# EAGLE design Dot_4layer_7 (EAGLE 4.16)
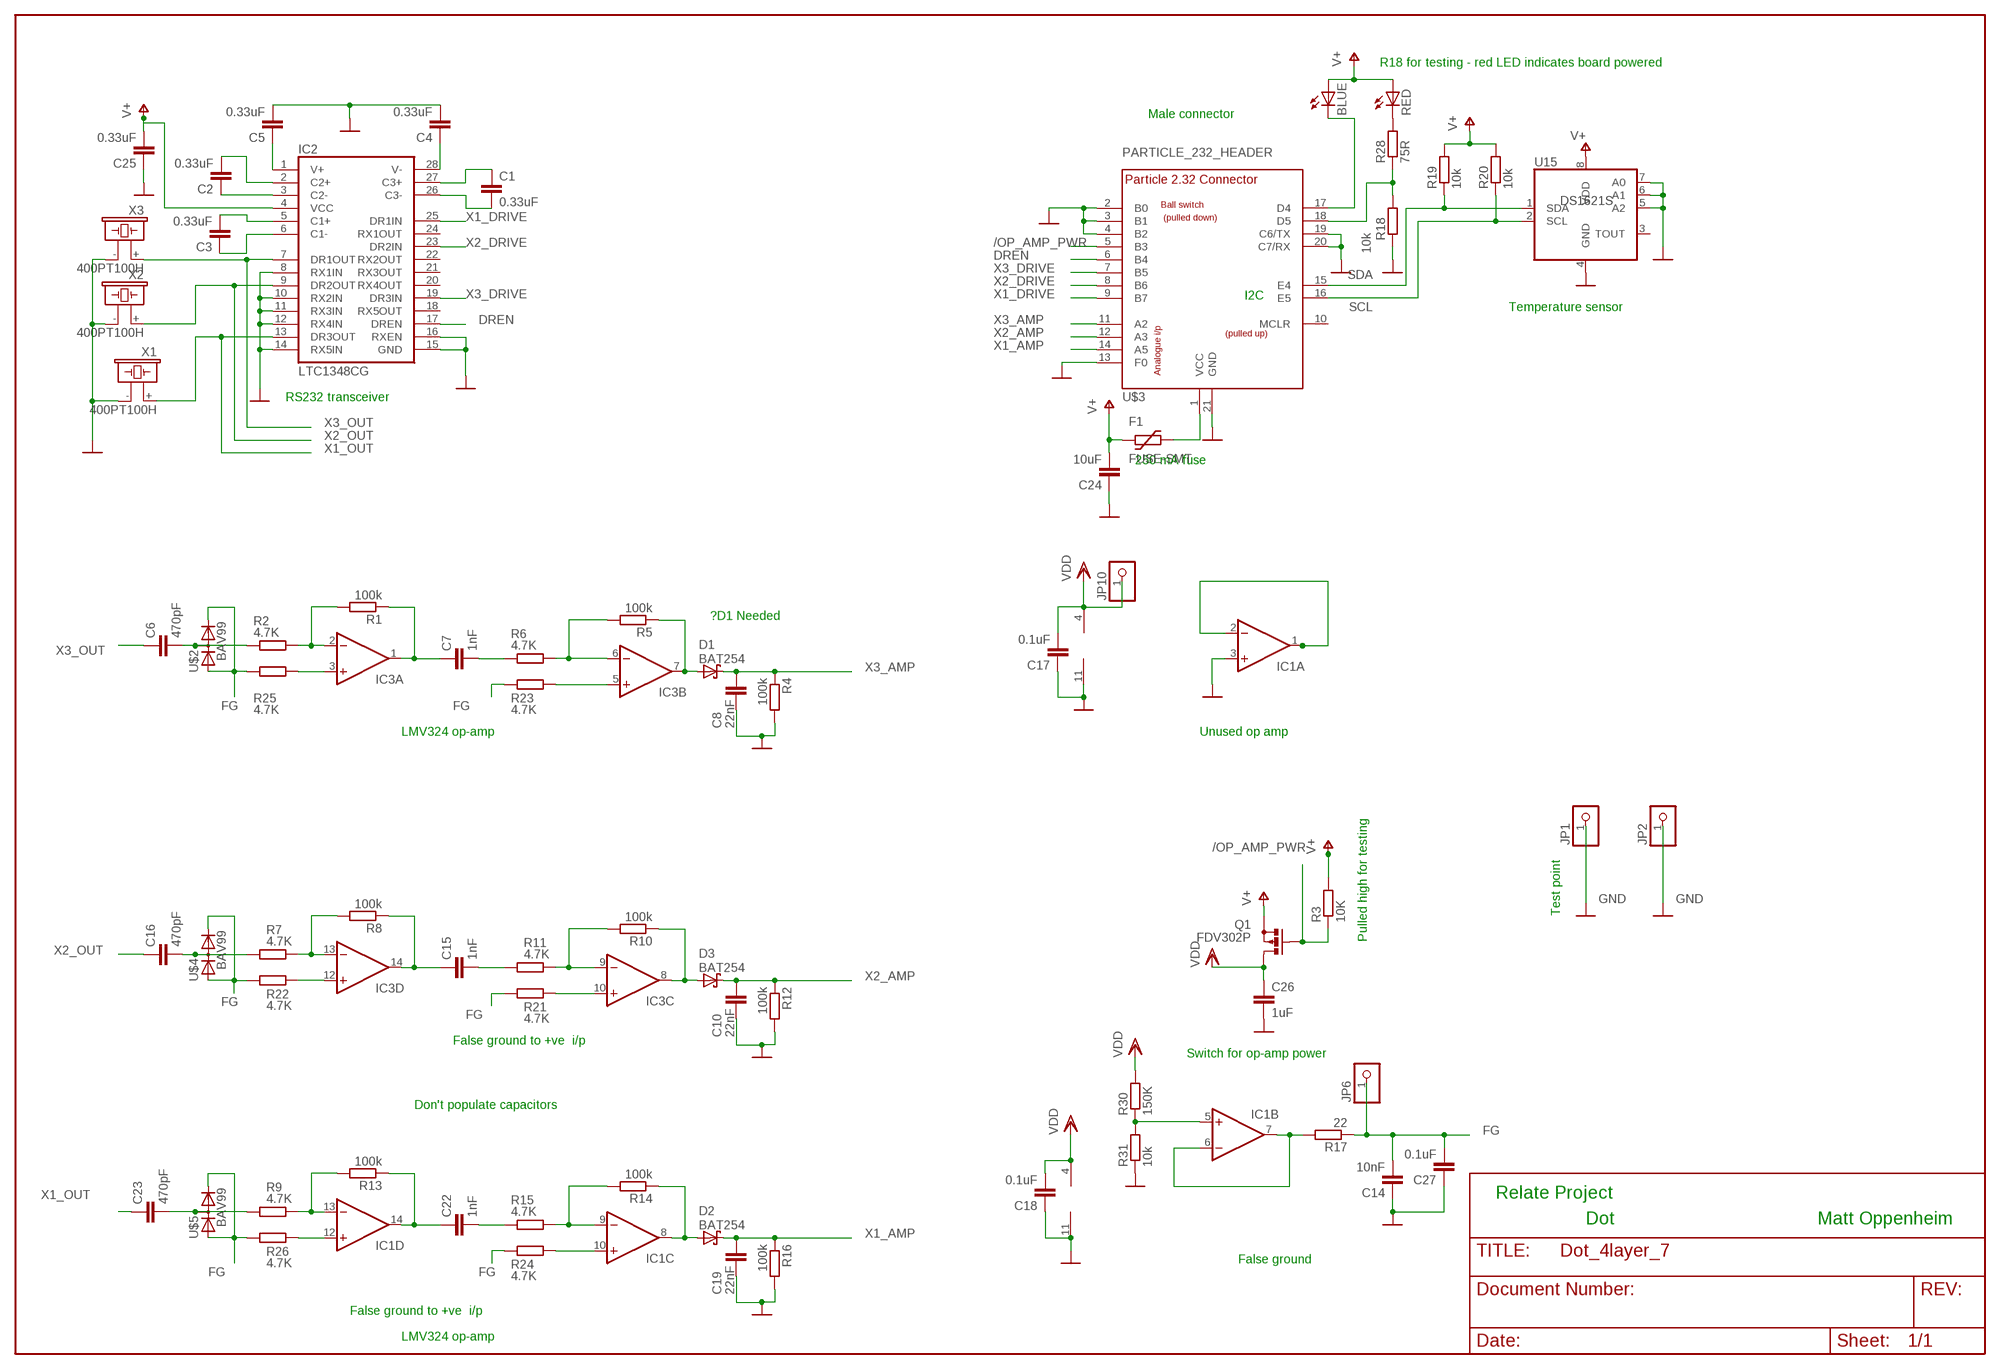
[diagram p0: schematic, sheet 1]

## Parts
BLUE  LEDCHIP-LED0805  [CHIP-LED0805]
C1  0.33uF  C-EUC0603  [C0603]
C2  0.33uF  C-EUC0603  [C0603]
C3  0.33uF  C-EUC0603  [C0603]
C4  0.33uF  C-EUC0603  [C0603]
C5  0.33uF  C-EUC0603  [C0603]
C6  470pF  C-EUC0603  [C0603]
C7  1nF  C-EUC0603  [C0603]
C8  22nF  C-EUC0603  [C0603]
C10  22nF  C-EUC0603  [C0603]
C14  10nF  C-EUC0603  [C0603]
C15  1nF  C-EUC0603  [C0603]
C16  470pF  C-EUC0603  [C0603]
C17  0.1uF  C-EUC0603  [C0603]
C18  0.1uF  C-EUC0603  [C0603]
C19  22nF  C-EUC0603  [C0603]
C22  1nF  C-EUC0603  [C0603]
C23  470pF  C-EUC0603  [C0603]
C24  10uF  C-EUC0603  [C0603]
C25  0.33uF  C-EUC0603  [C0603]
C26  1uF  C-EUC0603  [C0603]
C27  0.1uF  C-EUC0603  [C0603]
D1  BAT254  [SOD110-W]
D2  BAT254  [SOD110-W]
D3  BAT254  [SOD110-W]
F1  FUSE-SMT  [R0603]
IC1  AD8544RU  [TSSOP14]
IC2  LTC1348CG  [SSOP28]
IC3  AD8544RU  [TSSOP14]
JP1  PINHD-1X1  [1X01]
JP2  PINHD-1X1  [1X01]
JP6  PINHD-1X1  [1X01]
JP10  PINHD-1X1  [1X01]
Q1  FDV302P  [SOT23]
R1  100k  R-EU_R0603  [R0603]
R2  4.7K  R-EU_R0603  [R0603]
R3  10K  R-EU_R0603  [R0603]
R4  100k  R-EU_R0603  [R0603]
R5  100k  R-EU_R0603  [R0603]
R6  4.7K  R-EU_R0603  [R0603]
R7  4.7K  R-EU_R0603  [R0603]
R8  100k  R-EU_R0603  [R0603]
R9  4.7K  R-EU_R0603  [R0603]
R10  100k  R-EU_R0603  [R0603]
R11  4.7K  R-EU_R0603  [R0603]
R12  100k  R-EU_R0603  [R0603]
R13  100k  R-EU_R0603  [R0603]
R14  100k  R-EU_R0603  [R0603]
R15  4.7K  R-EU_R0603  [R0603]
R16  100k  R-EU_R0603  [R0603]
R17  22  R-EU_R0603  [R0603]
R18  10k  R-EU_R0603  [R0603]
R19  10k  R-EU_R0603  [R0603]
R20  10k  R-EU_R0603  [R0603]
R21  4.7K  R-EU_R0603  [R0603]
R22  4.7K  R-EU_R0603  [R0603]
R23  4.7K  R-EU_R0603  [R0603]
R24  4.7K  R-EU_R0603  [R0603]
R25  4.7K  R-EU_R0603  [R0603]
R26  4.7K  R-EU_R0603  [R0603]
R28  75R  R-EU_R0603  [R0603]
R30  150K  R-EU_R0603  [R0603]
R31  10k  R-EU_R0603  [R0603]
RED  LEDCHIP-LED0805  [CHIP-LED0805]
U15  DS1621S  [SO08]
U$2  BAV99  [SOT23]
U$3  PARTICLE_232_HEADER  [CONAN-91911-31X21]
U$4  BAV99  [SOT23]
U$5  BAV99  [SOT23]
X1  400PT100H  [PIEZOULTRASONIC10MM]
X2  400PT100H  [PIEZOULTRASONIC10MM]
X3  400PT100H  [PIEZOULTRASONIC10MM]

## Nets
/OP_AMP_PWR: Q1.1(G) R3.1 U$3.5(B3)
DREN: IC2.17(DREN) U$3.6(B4)
FG: C14.2 C27.2 JP6.1 R17.1 R21.1 R22.1 R23.1 R24.1 R25.1 R26.1 U$2.1(C) U$2.2(A) U$4.1(C) U$4.2(A) U$5.1(C) U$5.2(A)
GND: C4.2 C5.2 C8.2 C10.2 C14.1 C17.1 C18.1 C19.2 C24.1 C25.1 C26.2 C27.1 IC1.3(A:+IN) IC1.11(P:V-) IC2.8(RX1IN) IC2.10(RX2IN) IC2.11(RX3IN) IC2.12(RX4IN) IC2.14(RX5IN) IC2.15(GND) IC2.16(RXEN) IC3.11(P:V-) JP1.1 JP2.1 R4.2 R12.2 R16.2 R18.1 R31.1 U15.4(GND) U15.5(A2) U15.6(A1) U15.7(A0) U$3.2(B0) U$3.3(B1) U$3.4(B2) U$3.13(F0) U$3.19(C6/TX) U$3.20(C7/RX) U$3.21(GND) X1.- X2.- X3.-
N$1: C1.1 IC2.27(C3+)
N$2: C1.2 IC2.26(C3-)
N$3: IC1.1(A:OUT) IC1.2(A:-IN)
N$4: C6.2 R2.1 U$2.3(AC)
N$5: IC3.13(D:-IN) R7.2 R8.2
N$6: IC1.13(D:-IN) R9.2 R13.2
N$7: IC3.2(A:-IN) R1.2 R2.2
N$8: C7.1 IC3.1(A:OUT) R1.1
N$9: C3.1 IC2.6(C1-)
N$10: C3.2 IC2.5(C1+)
N$11: C2.1 IC2.3(C2-)
N$12: C2.2 IC2.2(C2+)
N$13: C5.1 IC2.1(V+)
N$14: C4.1 IC2.28(V-)
N$15: IC3.6(B:-IN) R5.2 R6.2
N$16: IC1.6(B:-IN) IC1.7(B:OUT) R17.2
N$17: D1.A IC3.7(B:OUT) R5.1
N$18: C15.1 IC3.14(D:OUT) R8.1
N$19: IC1.5(B:+IN) R30.1 R31.2
N$20: C7.2 R6.1
N$21: IC3.9(C:-IN) R10.2 R11.2
N$22: D3.A IC3.8(C:OUT) R10.1
N$23: C15.2 R11.1
N$24: C16.2 R7.1 U$4.3(AC)
N$25: IC1.12(D:+IN) R26.2
N$26: C22.1 IC1.14(D:OUT) R13.1
N$27: F1.2 U$3.1(VCC)
N$28: IC1.9(C:-IN) R14.2 R15.2
N$29: D2.A IC1.8(C:OUT) R14.1
N$30: C22.2 R15.1
N$31: C23.2 R9.1 U$5.3(AC)
N$32: IC3.10(C:+IN) R21.2
N$33: IC3.12(D:+IN) R22.2
N$34: IC3.5(B:+IN) R23.2
N$35: IC1.10(C:+IN) R24.2
N$36: IC3.3(A:+IN) R25.2
N$38: R28.2 RED.C
N$39: R18.2 R28.1 U$3.18(D5)
N$40: BLUE.C U$3.17(D4)
SCL: R20.1 U15.2(SCL) U$3.16(E5)
SDA: R19.1 U15.1(SDA) U$3.15(E4)
V+: BLUE.A C24.2 C25.2 F1.1 IC2.4(VCC) Q1.2(S) R3.2 R19.2 R20.2 RED.A U15.8(VDD)
VDD: C17.2 C18.2 C26.1 IC1.4(P:V+) IC3.4(P:V+) JP10.1 Q1.3(D) R30.2
X1_AMP: C19.1 D2.C R16.1 U$3.14(A5)
X1_DRIVE: IC2.25(DR1IN) U$3.9(B7)
X1_OUT: C23.1 IC2.13(DR3OUT) X1.+
X2_AMP: C10.1 D3.C R12.1 U$3.12(A3)
X2_DRIVE: IC2.23(DR2IN) U$3.8(B6)
X2_OUT: C16.1 IC2.9(DR2OUT) X2.+
X3_AMP: C8.1 D1.C R4.1 U$3.11(A2)
X3_DRIVE: IC2.19(DR3IN) U$3.7(B5)
X3_OUT: C6.1 IC2.7(DR1OUT) X3.+
Unconnected: IC2.18(RX5OUT) IC2.20(RX4OUT) IC2.21(RX3OUT) IC2.22(RX2OUT) IC2.24(RX1OUT) U15.3(TOUT) U$3.10(MCLR)

## Notes on the sheet
- R18 for testing - red LED indicates board powered
- Male connector
- I2C
- Temperature sensor
- RS232 transceiver
- 250 mA fuse
- ?D1 Needed
- LMV324 op-amp | Unused op amp
- Test point
- Pulled high for testing
- False ground to +ve  i/p
- Switch for op-amp power
- Don't populate capacitors
- Relate Project
- Dot | Matt Oppenheim
- False ground
- False ground to +ve  i/p
- LMV324 op-amp

## Library data of the parts
BLUE RED = led:LED: LED OSRAM: - CHIPLED LG R971, LG N971, LY N971, LG Q971, LY Q971, LO R971, LY R971 LH N974, LH R974 LS Q976, LO Q976, LY Q976 LO Q996 - Hyper CHIPLED LW Q18S LB Q993, LB Q99A, LB R99A - SideLED LS A670, LO A670, LY A670, LG A670, LP A670 LB A673, LV A673, LT A673, LW A673 LH A674 LY A675 LS A676, LA A676, LO A676, LY A676, LW A676 LS A679, LY A679, LG A679 - Hyper Micro SIDELED® LS Y876, LA Y876, LO Y876, LY Y876 LT Y87S - SmartLED LW L88C, LW L88S LB L89C, LB L89S, LG L890 LS L89K, LO L89K, LY L89K LS L896, LA L896, LO L896, LY L896 - TOPLED LS T670, LO T670, LY T670, LG T670, LP T670 LSG T670, LSP T670, LSY T670, LOP T670, LYG T670 LG T671, LOG T671, LSG T671 LB T673, LV T673, LT T673, LW T673 LH T674 LS T676, LA T676, LO T676, LY T676, LB T676, LH T676, LSB T676, LW T676 LB T67C, LV T67C, LT T67C, LS T67K, LO T67K, LY T67K, LW E67C LS E67B, LA E67B, LO E67B, LY E67B, LB E67C, LV E67C, LT E67C LW T67C LS T679, LY T679, LG T679 LS T770, LO T770, LY T770, LG T770, LP T770 LB T773, LV T773, LT T773, LW T773 LH T774 LS E675, LA E675, LY E675, LS T675 LS T776, LA T776, LO T776, LY T776, LB T776 LHGB T686 LT T68C, LB T68C - Hyper Mini TOPLED® LB M676 - Mini TOPLED Santana® LG M470 LS M47K, LO M47K, LY M47K Source: http://www.osram.convergy.de/
C1-C8 C10 C14-C19 C22-C27 = rcl:C-EU: CAPACITOR, European symbol
D1-D3 = Dot boards:BAT254
F1 = Temp:FUSE-SMT
IC1 IC3 = Dot boards:AD8544: OP AMP
IC2 = Dot boards:LTC1348*: 3.3V/5V low power RS232 3-driver/5-receiver transceiver Linear Technology
JP1 JP2 JP6 JP10 = pinhead:PINHD-1X1: PIN HEADER
Q1 = hazas:FDV302P: PMOSFET
R1-R26 R28 R30 R31 = rcl:R-EU_: RESISTOR, European symbol
U15 = hazas:DS1621
U$2 U$4 U$5 = Temp:BAV99
U$3 = Dot boards:PARTICLE_232
X1-X3 = Dot boards:400PT100*: 400PT100 40kHz Transducer Prowave 40kHz transducer.

## Board
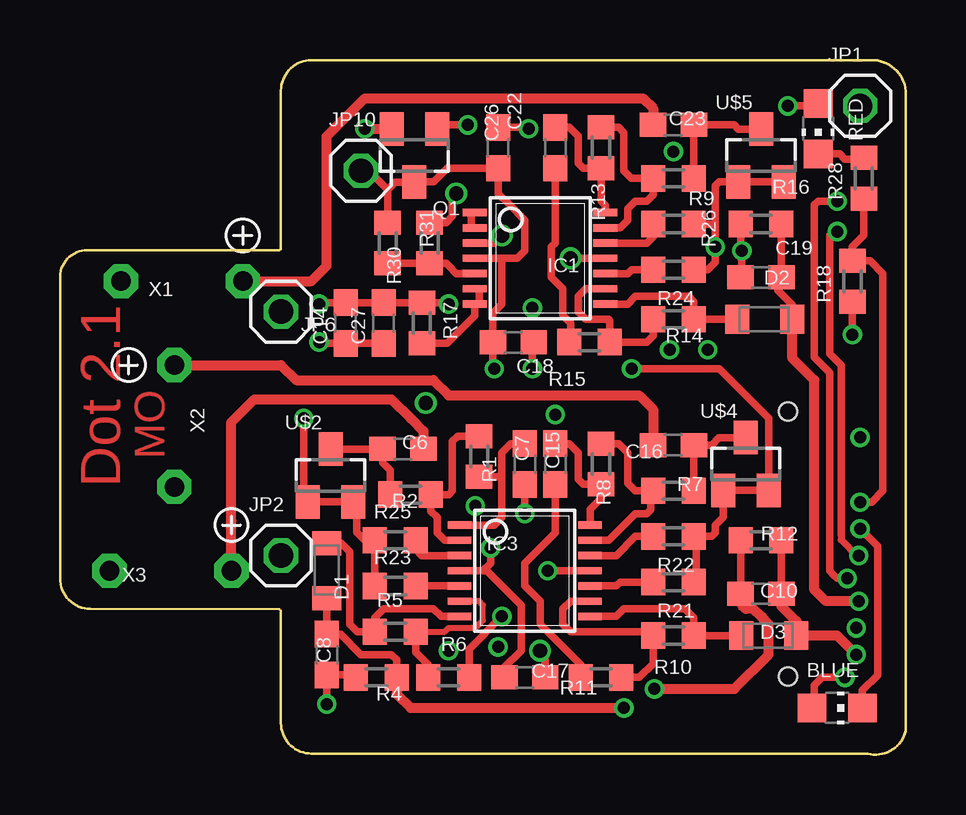
[diagram p1: board, top side]
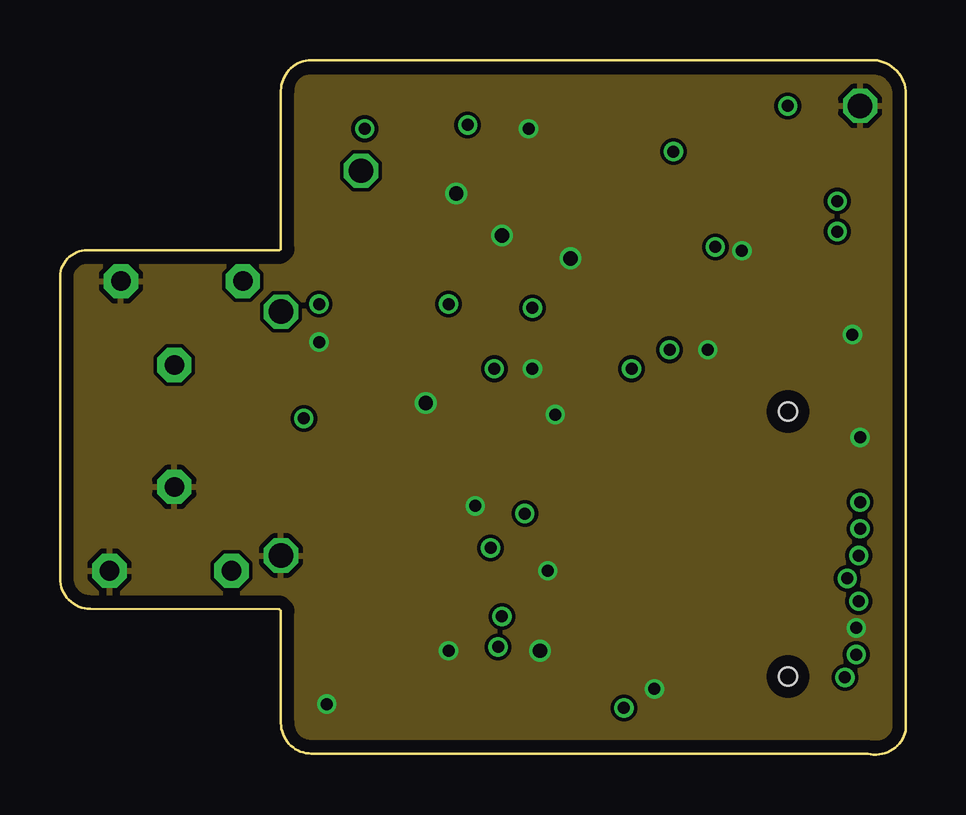
[diagram p2: board, inner layer Route2]
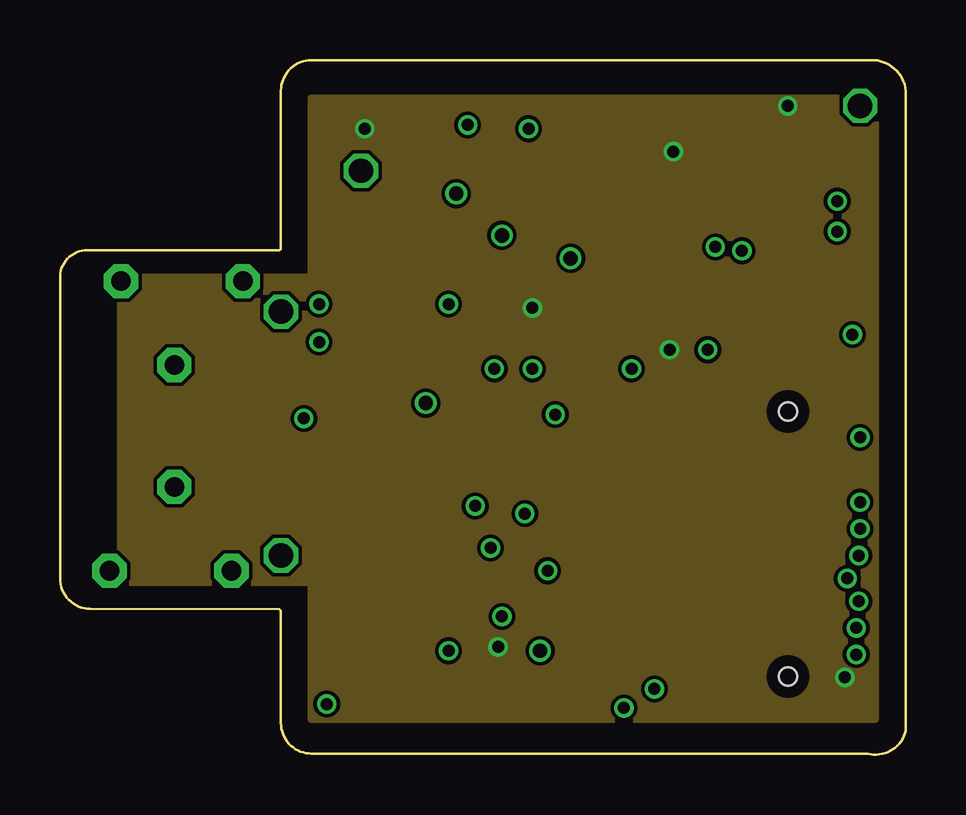
[diagram p3: board, inner layer Route15]
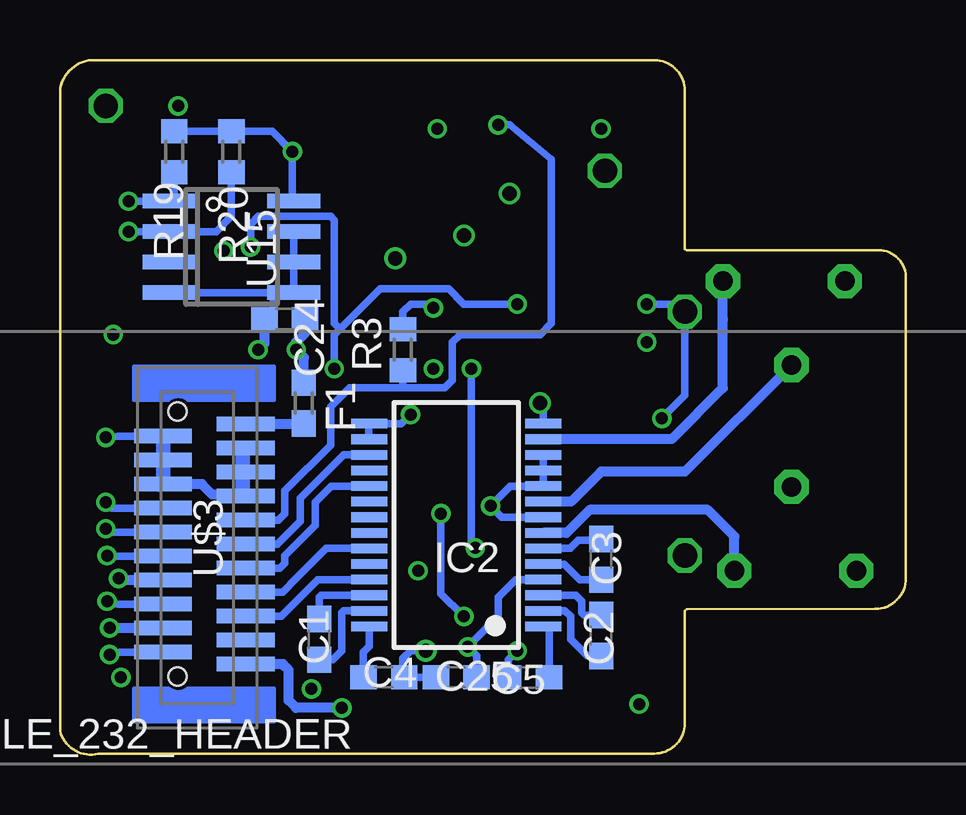
[diagram p4: board, bottom side, seen from below]

Size 35.24 x 28.94 mm. Coordinates in mm from the lower left corner, seen from the top.
Outline: 9.13,21 1.37,21 arc90 0,20.04 0,7.34 arc90 1.27,6.07 9.13,6.06
Outline: 9.21,21.06 9.21,27.66 arc-90 10.48,28.93 33.66,28.93 arc-90 35.24,27.66 35.24,0.99 arc-90 33.66,0.04 10.48,0.04 arc-90 9.21,1.31 9.21,5.98
Copper layers (1+2*15+16): Top 0.035mm / dielectric 1.5mm / Route2 0.035mm / dielectric 0.15mm / Route15 0.035mm / dielectric 0.2mm / Bottom 0.035mm
Design rules "PCB-POOL": minimum track width 6mil, minimum drill 12mil, track to track 6mil, track to pad 6mil, pad to pad 6mil, via to via 6mil, smd to smd 6mil, copper to edge 20mil, drill to drill 8mil, minimum pad ring 8mil, minimum via ring 6mil, stop-mask expansion 3mil, vias tented up to drill 0mil, thermal gap 8mil

### Footprints (pad centres in the part's own frame; a part is rotated, then mirrored left to right if it is on the bottom)
CHIP-LED0805 = smd 1.2 x 1.2: A 0,-1.05; C 0,1.05
C0603 = smd 1.1 x 1: 1 -0.85,0; 2 0.85,0
SOD110-W = smd 1 x 1.2: A 1.15,0; C -1.15,0
R0603 = smd 1.1 x 1: 1 -0.85,0; 2 0.85,0
TSSOP14 = smd 0.305 x 0.991: 1 -1.905,-2.718; 2 -1.27,-2.718; 3 -0.635,-2.718; 4 0,-2.718; 5 0.635,-2.718; 6 1.27,-2.718; 7 1.905,-2.718; 8 1.905,2.718; 9 1.27,2.718; 10 0.635,2.718; 11 0,2.718; 12 -0.635,2.718; 13 -1.27,2.718; 14 -1.905,2.718
SSOP28 = smd 0.4 x 1.5: 1 -4.225,-3.625; 2 -3.575,-3.625; 3 -2.925,-3.625; 4 -2.275,-3.625; 5 -1.625,-3.625; 6 -0.975,-3.625; 7 -0.325,-3.625; 8 0.325,-3.625; 9 0.975,-3.625; 10 1.625,-3.625; 11 2.275,-3.625; 12 2.925,-3.625; 13 3.575,-3.625; 14 4.225,-3.625; 15 4.225,3.625; 16 3.575,3.625; 17 2.925,3.625; 18 2.275,3.625; 19 1.625,3.625; 20 0.975,3.625; 21 0.325,3.625; 22 -0.325,3.625; 23 -0.975,3.625; 24 -1.625,3.625; 25 -2.275,3.625; 26 -2.925,3.625; 27 -3.575,3.625; 28 -4.225,3.625
1X01 = drill 1.016 octagon: 1 0,0
SOT23 = smd 1 x 1.4: 1 -0.95,-1.1; 2 0.95,-1.1; 3 0,1.1
R0603' = smd 1 x 1.1: 1 -0.85,0; 2 0.85,0
SO08 = smd 0.6 x 2.2: 1 -1.905,-2.6; 2 -0.635,-2.6; 3 0.635,-2.6; 4 1.905,-2.6; 5 1.905,2.6; 6 0.635,2.6; 7 -0.635,2.6; 8 -1.905,2.6
CONAN-91911-31X21 = smd 0.61 x 2.41: 1 -5,1.7; 2 -4,1.7; 3 -3,1.7; 4 -2,1.7; 5 -1,1.7; 6 0,1.7; 7 1,1.7; 8 2,1.7; 9 3,1.7; 10 4,1.7; 11 5,1.7; 12 4.5,-1.74; 13 3.5,-1.74; 14 2.5,-1.74; 15 1.5,-1.74; 16 0.5,-1.74; 17 -0.5,-1.74; 18 -1.5,-1.74; 19 -2.5,-1.74; 20 -3.5,-1.74; 21 -4.5,-1.74 | hole 0.76: -5.52,-1.13; 5.52,-1.13
PIEZOULTRASONIC10MM = drill 0.813 pad 1.422 octagon: + 2.54,0; - -2.54,0

### Placement (x,y rotation side)
BLUE  32.38,1.94 270 top
C1  24.45,4.8 90 bottom
C2  12.7,4.96 270 bottom
C3  12.7,8.13 270 bottom
C4  21.75,3.21 0 bottom
C5  15.72,3.21 180 bottom
C6  14.29,12.74 180 top
C7  19.37,12.1 270 top
C8  11.11,4.17 270 top
C10  29.21,6.71 180 top
C14  11.91,17.98 90 top
C15  20.64,12.1 270 top
C16  25.56,12.9 0 top
C17  19.37,3.21 180 top
C18  18.89,17.18 180 top
C19  29.21,19.88 180 top
C22  20.64,25.28 270 top
C23  25.56,26.23 0 top
C24  25.88,18.14 0 bottom
C25  18.73,3.21 0 bottom
C26  18.26,25.28 90 top
C27  13.49,17.98 90 top
D1  11.11,7.66 90 top
D2  29.37,18.14 180 top
D3  29.53,4.96 180 top
F1  25.08,14.64 270 bottom
IC1  20,20.68 270 top
IC2  18.73,9.56 90 bottom
IC3  19.37,7.66 270 top
JP1  33.34,27.03 0 top
JP2  9.21,8.29 0 top
JP6  9.21,18.45 90 top
JP10  12.54,24.33 0 top
Q1  14.76,24.96 180 top
R1  100k  [R0603']  17.46,12.42 90 top
R2  4.7K  [R0603']  14.61,10.83 0 top
R3  10K  [R0603']  20.95,16.87 90 bottom
R4  100k  [R0603']  13.18,3.21 180 top
R5  100k  [R0603']  13.97,5.12 0 top
R6  4.7K  [R0603']  16.19,3.21 180 top
R7  4.7K  [R0603']  25.56,10.99 180 top
R8  100k  [R0603']  22.54,12.1 90 top
R9  4.7K  [R0603']  25.56,24.01 180 top
R10  100k  [R0603']  25.56,4.96 180 top
R11  4.7K  [R0603']  22.54,3.21 0 top
R12  100k  [R0603']  29.21,8.93 180 top
R13  100k  [R0603']  22.54,25.28 90 top
R14  100k  [R0603']  25.56,18.14 180 top
R15  4.7K  [R0603']  22.07,17.18 0 top
R16  100k  [R0603']  29.21,22.1 180 top
R17  22  [R0603']  15.08,17.98 270 top
R18  10k  [R0603']  33.02,19.72 90 top
R19  10k  [R0603']  30.48,25.12 90 bottom
R20  10k  [R0603']  28.1,25.12 90 bottom
R21  4.7K  [R0603']  25.56,7.18 180 top
R22  4.7K  [R0603']  25.56,9.09 180 top
R23  4.7K  [R0603']  13.97,7.02 0 top
R24  4.7K  [R0603']  25.56,20.2 180 top
R25  4.7K  [R0603']  13.97,8.93 0 top
R26  4.7K  [R0603']  25.56,22.1 180 top
R28  75R  [R0603']  33.5,24.01 90 top
R30  150K  [R0603']  13.65,21.31 90 top
R31  10k  [R0603']  15.4,21.31 270 top
RED  31.59,26.07 180 top
U15  28.1,21.15 270 bottom
U$1  [PARTICLE]  29.53,8.61 0 bottom
U$2  11.27,11.63 0 top
U$3  29.21,8.77 270 bottom
U$4  28.58,12.1 0 top
U$5  29.21,24.96 0 top
X1  5.08,19.72 0 top
X2  4.76,13.69 90 top
X3  4.6,7.66 0 top

### Tracks (layer width: path | path; a pad name or v marks a point on that pad's centre or on a via)
/OP_AMP_PWR  (via drill 0.5)
  Top 0.305: Q1.1 15.86,26.06 16.03,26.23 v16.99,26.23
  Bottom 0.305: U$3.5 26.15,9.77 25.88,10.04 25.88,10.99 23.97,12.9 23.97,14.48 23.18,15.28 20.95,15.28 | v16.99,26.23 16.51,26.23 14.76,24.8 14.76,17.98 15.24,17.5 18.57,17.5 18.89,17.18 18.89,15.6 19.21,15.28 20.95,15.28 | 20.95,15.28 R3.1
DREN
  Bottom 0.305: IC2.17 23.43,12.49 25.24,10.67 25.24,9.72 26.19,8.77 | 26.19,8.77 U$3.6 | 26.19,8.77
FG  (via drill 0.5)
  Top 0.305: 13.65,18.77 13.6,18.83 C14.2 10.85,18.83 v10.79,18.77 | 13.65,18.77 | 13.65,18.77 C27.2 | 13.65,18.77 13.71,18.83 R17.1 16.14,18.83 v16.19,18.77 | R24.1 26.99,20.2 27.15,20.36 | 27.15,20.36 | 27.15,20.36 27.31,20.52 v27.31,21.15 27.31,22.1 | 26.51,7.18 R21.1 26.41,7.08 | 26.51,7.18 26.67,7.34 | v23.81,16.07 27.46,16.07 29.52,14.01 U$4.2 27.79,11 27.63,10.84 | 26.51,9.09 R22.1 | 26.51,9.09 27.15,9.09 27.31,9.25 27.31,9.56 27.63,9.88 U$4.1 27.63,10.84 | 26.41,7.08 26.35,7.02 | 26.51,9.09 26.51,7.18 | 26.51,7.18 26.41,7.08 | 27.63,10.84 27.62,10.83 | U$5.1 | U$5.1 27.48,23.86 27.31,23.69 27.31,22.1 | U$5.2 U$5.1 | 10.47,10.53 10.48,10.52 | 10.47,10.53 U$2.1 | v10.16,14.01 10.16,10.83 10.47,10.53 | 12.37,10.53 U$2.2 | 12.37,10.53 10.47,10.53 | 12.37,10.53 12.38,10.52 | 12.37,10.53 12.37,9.26 12.7,8.93 R25.1 13.12,7.13 13.02,7.02 R23.1 | 27.31,22.1 R26.1
  Bottom 0.305: v16.19,18.77 18.41,18.77 19.05,19.41 21.91,19.41 23.57,17.74 | v23.81,16.07 23.81,17.5 23.57,17.74 | JP6.1 9.52,18.77 v10.79,18.77 9.21,18.77 9.21,14.96 v10.16,14.01 | v27.31,21.15 27.31,22.1 26.99,22.42 23.97,22.42 23.81,22.26 23.81,17.98 23.57,17.74
GND  (via drill 0.5, 0.6)
  Top 0.305: IC1.3 18.1,21.31 v18.41,21.63 | IC1.11 v21.27,20.68 | 13.65,17.18 | 13.65,17.18 C27.1 10.85,17.13 v10.79,17.18 | C14.1 13.6,17.13 13.65,17.18 | C18.1 19.69,17.18 v19.69,16.07 | C26.2 19.42,26.13 v19.53,26.07 | v28.42,20.99 | R16.2 28.36,21.05 v28.42,20.99 | C10.2 28.42,6.71 28.36,6.76 R12.2 | v20.32,7.66 IC3.11 | v11.11,2.1 C8.2 12.28,3.32 12.38,3.21 R4.2 | 28.36,20.04 28.26,20.04 | C19.2 28.36,20.04 | v28.42,20.99 28.42,20.04 28.36,20.04 | v20,4.32 | v20,4.32 20.06,4.27 | v33.02,17.5 R18.1 | R31.1 16.09,22.16 16.35,22.42 16.35,23.06 16.51,23.22 v16.51,23.37 | v20,4.32 20,4.17 20.22,3.95 C17.1
  Top 0.406: 28.42,6.71 28.42,6.23 28.58,6.07 28.89,6.07 29.21,5.75 | 29.21,5.75 | 29.37,5.59 29.21,5.75 | 29.37,5.59 | 29.37,5.59 29.53,5.44 29.53,4.17 28.1,2.74 v24.77,2.74
  Bottom 0.305: IC2.11 IC2.10 16.47,11.19 v17.3,10.36 | IC2.11 IC2.12 15.11,11.92 15.19,11.84 | v20,4.32 20.64,4.32 20.95,4.01 20.95,3.21 | U15.5 U15.6 | U15.6 U15.7 | 26.35,18.14 | 26.35,18.14 C24.1 | 25.56,19.25 26.35,19.25 26.35,18.14 | 25.56,19.25 U15.4 | U15.5 U15.6 | U15.5 25.56,19.25 | U$3.21 32.81,13.27 v33.34,13.21 | 20.95,3.21 C4.2 | C25.1 20.95,3.21 | 15.19,11.84 15.24,11.79 | IC2.11 15.19,11.84 | 22.38,13.79 22.38,13.85 | 22.38,13.79 IC2.15 21.02,13.79 v20.64,14.17 | IC2.16 22.38,13.14 22.38,13.79 | v15.24,14.64 | IC2.14 15.11,14.51 v15.24,14.64 | C5.2 16.57,3.95 v16.19,4.32 | IC2.8 16.84,9.89 v17.3,10.36 | v17.3,10.36
  Bottom 0.406: 27.62,10.77 27.62,10.83 28.89,10.83 29.33,11.27 U$3.19 31,11.27 | v33.18,5.28 32.86,5.28 32.85,5.27 U$3.13 | 31,11.27 31.12,11.15 | U$3.20 30.95,11.32 31,11.27 | C24.1 26.73,17.13 v26.99,16.87
  Bottom 0.61: U$3.2 27.62,12.77 27.62,11.77 | U$3.4 27.62,10.77 27.62,11.77 | U$3.3 27.62,11.77 | U$3.19 30.95,11.31 | 30.95,11.31 U$3.20 U$3.21 | 30.95,11.31 31.12,11.31
  pour Route2: 0.48,6.39 0.48,20.68 9.37,20.83 9.37,28.3 34.61,28.3 34.61,0.67 9.41,0.67 9.41,6.39
N$1
  Bottom 0.305: IC2.27 23.42,5.99 23.49,5.91 23.49,4.32 23.87,3.95 C1.1
N$2
  Bottom 0.305: IC2.26 24.36,6.64 24.45,6.55 C1.2
N$3
  Top 0.305: IC1.1 17.14,22.58 17.14,21.95 IC1.2
N$4
  Top 0.305: U$2.3 13.32,12.73 13.34,12.74 C6.2 13.44,12.16 13.75,11.84 R2.1
N$5
  Top 0.305: IC3.13 22.86,8.93 23.97,10.04 24.45,10.04 24.61,10.2 24.61,10.83 24.71,10.94 R7.2 23.97,10.99 23.65,11.31 23.65,12.58 23.28,12.95 R8.2
N$6
  Top 0.305: R13.2 23.28,26.13 23.49,25.91 23.49,24.33 23.81,24.01 R9.2 24.71,23.32 24.45,23.06 23.97,23.06 23.65,22.74 23.65,22.26 23.34,21.95 IC1.13
N$7
  Top 0.305: R1.2 16.57,13.27 16.35,13.06 16.35,10.99 16.19,10.83 R2.2 15.45,10.14 15.72,9.88 15.72,9.25 16.03,8.93 IC3.2
N$8
  Top 0.305: IC3.1 18.1,9.56 18.41,9.88 18.41,11.47 | 18.41,11.47 18.41,11.63 | 18.41,11.63 18.41,11.79 | 18.41,11.63 18.41,12.58 18.79,12.95 C7.1 | R1.1 18.31,11.57 18.41,11.47
N$9
  Bottom 0.305: IC2.6 13.99,8.59 13.65,8.93 13.02,8.93 12.96,8.98 C3.1
N$10
  Bottom 0.305: IC2.5 14.96,7.94 14.92,7.98 14.87,7.92 14.23,7.92 13.6,7.28 C3.2
N$11
  Bottom 0.305: C2.1 13.39,5.81 13.49,5.91 13.49,6.39 13.74,6.64 IC2.3
N$12
  Bottom 0.305: C2.2 13.28,4.11 13.97,4.8 13.97,5.75 14.2,5.99 IC2.2
N$13
  Bottom 0.305: IC2.1 15.11,5.28 14.87,5.28 C5.1
N$14
  Bottom 0.305: IC2.28 22.36,4.51 22.6,4.27 C4.1
N$15
  Top 0.254: IC3.6 17.46,6.39 17.62,6.23 17.62,5.59 17.46,5.44 17.3,5.28 16.19,5.28 16.03,5.12 R5.2
  Top 0.305: R5.2 14.82,4.27 15.34,3.75 R6.2
N$16
  Top 0.305: R17.2 16.14,17.13 17.28,18.28 IC1.7 17.46,18.77 17.46,19.41 IC1.6
N$17
  Top 0.305: IC3.7 15.88,5.75 15.56,6.07 13.49,6.07 13.12,5.7 R5.1 12.38,5.12 12.06,5.44 12.06,8.45 11.71,8.81 D1.A
N$18
  Top 0.305: C15.1 21.22,12.95 21.59,12.58 21.59,11.47 21.81,11.25 R8.1 | IC3.14 22.09,10.22 22.54,10.67 R8.1 | R8.1 22.54,11.31
N$19
  Top 0.305: IC1.5 16.51,20.04 16.19,20.36 16.09,20.46 R31.2 15.45,20.46 15.46,20.46 | R30.1 15.46,20.46 | 15.46,20.46 15.56,20.36
N$20  (via drill 0.5)
  Top 0.305: 19.37,10.2 | v19.37,10.04 19.37,10.2 | 19.37,10.2 C7.2 | R6.1 17.04,4.38 v18.42,5.75
  Bottom 0.305: v18.41,5.75 v18.42,5.75 19.37,6.71 v19.37,10.04
N$21
  Top 0.305: R11.2 24.13,3.21 24.71,3.79 R10.2 24.71,5.06 24.77,5.12 21.27,5.12 20.95,5.44 20.95,6.07 21.27,6.39 IC3.9
N$22
  Top 0.305: D3.A R10.1 26.41,5.7 26.03,6.07 23.49,6.07 23.18,5.75 IC3.8
N$23
  Top 0.305: C15.2 20.64,9.25 19.37,7.98 19.37,7.02 20,6.39 20,5.44 21.69,3.75 R11.1
N$24
  Top 0.305: R7.1 26.41,11.09 26.35,11.15 26.41,11.21 C16.2 27.15,12.9 27.45,13.2 U$4.3
N$25
  Top 0.305: R26.2 24.71,21.57 24.45,21.31 IC1.12
N$26
  Top 0.305: IC1.14 22.72,22.88 22.54,23.06 R13.1 21.81,24.43 21.59,24.64 21.59,25.76 21.22,26.13 C22.1
N$27
  Bottom 0.406: 25.32,13.77 U$3.1
  Bottom 0.61: F1.2 25.08,14.01 25.32,13.77
N$28
  Top 0.305: IC1.9 21.91,19.41 21.59,19.09 21.59,18.45 21.91,18.14 22.86,18.14 22.92,18.08 R15.2 24.45,17.18 24.71,17.44 R14.2
N$29
  Top 0.305: D2.A R14.1 26.41,18.87 26.19,19.09 23.97,19.09 23.65,18.77 IC1.8
N$30
  Top 0.305: 21.27,17.18 | R15.1 21.27,17.18 | 21.27,17.18 21.27,17.98 20.95,18.29 20.95,19.41 20.48,19.88 20.48,21.15 20.64,21.31 C22.2
N$31
  Top 0.305: U$5.3 28.27,26.06 28.1,26.23 C23.2 26.41,24.27 26.51,24.17 26.41,24.07 R9.1
N$32
  Top 0.305: IC3.10 23.18,7.02 23.34,7.18 R21.2
N$33
  Top 0.305: IC3.12 23.18,8.29 23.97,9.09 R22.2
N$34
  Top 0.305: R23.2 15.56,7.02 | 15.56,7.02 15.72,7.02 | 15.56,7.02 IC3.5
N$35
  Top 0.305: R24.2 23.81,20.2 23.65,20.04 IC1.10
N$36
  Top 0.305: R25.2 14.82,8.55 15.08,8.29 IC3.3
N$38
  Top 0.305: RED.C 32.48,25.02 32.7,24.8 33.34,24.8 33.39,24.86 R28.2
N$39  (via drill 0.5)
  Top 0.305: v33.34,10.52 33.81,10.52 34.29,10.99 34.29,20.04 33.76,20.57 R18.2 33.02,21.15 33.5,21.63 R28.1 33.5,23.37
  Bottom 0.305: U$3.18 33.09,10.27 v33.34,10.52
N$40  (via drill 0.5)
  Top 0.305: BLUE.C 33.44,2.68 34.07,3.31 34.07,8.67 v33.34,9.4
  Bottom 0.305: U$3.17 33.31,9.27 v33.34,9.4
SCL  (via drill 0.5)
  Top 0.3: v33.28,8.29 33.2,8.29 32.54,8.95 32.54,9.13
  Top 0.305: v32.38,21.79 32.23,21.79 32.07,21.63 32.07,16.71 32.54,16.23 32.54,9.13
  Bottom 0.305: R20.1 28.1,22.42 28.73,21.79 U15.2 v32.38,21.79 | v33.28,8.29 33.18,8.29 33.16,8.27 U$3.16
SDA  (via drill 0.5)
  Top 0.305: v32.38,23.06 31.59,23.06 31.43,22.9 31.43,16.55 32.07,15.91 32.07,7.66 | 32.07,7.66 | 32.23,7.5 32.07,7.66 | v32.8,7.34 32.38,7.34 32.23,7.5 | 32.23,7.5
  Bottom 0.305: R19.1 30.48,23.22 30.64,23.06 U15.1 v32.38,23.06
  Bottom 0.406: v32.8,7.34 32.7,7.34 32.63,7.27 U$3.15
V+  (via drill 0.5)
  Top 0.305: RED.A 31.75,27.03 v30.32,27.03 | v32.7,3.21 31.75,3.21 31.43,2.9 31.43,1.94 BLUE.A
  Top 0.406: Q1.2 13.66,26.06 13.65,26.07 v12.7,26.07
  Bottom 0.305: R3.2 20.95,18.45 20.64,18.77 19.69,18.77 v19.69,18.61 | U15.8 25.4,23.06 25.5,23.16 25.56,23.16 v25.56,25.12 | 27.94,25.97 R20.2 26.41,25.97 v25.56,25.12 | 27.94,25.97 R19.2 | 27.94,25.97 27.94,26.07 | v25.56,25.12 | IC2.4 16.25,7.29 16.99,6.55 16.99,5.75 v18.26,4.48 | C25.2 17.88,4.11 v18.26,4.48 | v18.26,4.48
  Bottom 0.406: F1.1 25.08,16.55 v25.4,16.87 25.4,17.18 25.24,17.34 | 25.24,17.34 | C24.2 25.03,17.56 25.24,17.34
  pour Route15: 2.54,19.88 10.48,19.88 10.48,27.34 33.97,27.34 33.97,1.47 10.48,1.47 10.48,7.18 2.54,7.18
VDD  (via drill 0.5)
  Top 0.305: 18.41,20.68 IC1.4 | 18.41,20.68 19.05,20.68 19.37,20.99 19.37,22.26 18.73,22.9 | 18.73,22.9 | 18.73,22.9 18.26,23.37 C26.1 16.14,24.43 15.57,23.86 Q1.3 14.62,23.86 14.61,23.85 13.97,23.85 13.65,23.53 | 18.41,20.68 18.41,18.77 18.04,18.4 C18.2 18.04,16.13 v18.1,16.07 | 13.65,23.53 R30.2 | 17.62,7.66 17.78,7.66 18.1,7.34 | 17.62,7.66 IC3.4 | 18.1,7.34 | 18.26,7.18 18.1,7.34 | 18.26,7.18 | v17.94,8.61 17.94,7.98 17.62,7.66 | 13.65,23.53 | JP10.1 12.86,24.33 13.65,23.53 | 18.26,7.18 19.05,6.39 19.21,6.23 19.21,4.32 18.52,3.63 C17.2
  Bottom 0.305: v17.94,8.61 18.1,8.77 v18.1,16.07
X1_AMP  (via drill 0.5)
  Top 0.305: D2.C 30.52,18.73 29.9,19.35 C19.1 30.06,19.83 | 30.06,19.83 R16.1 | 30.06,19.83 30.16,19.72
  Top 0.406: 30.8,17.82 D2.C 30.52,16.51 31.43,15.6 31.43,6.86 31.91,6.39 v33.28,6.39
  Bottom 0.305: U$3.14 32.82,6.27 v33.28,6.39
X1_DRIVE
  Bottom 0.305: IC2.25 24.5,7.29 26.02,5.77 U$3.9
X1_OUT
  Top 0.406: X1.+ 10.48,19.72 11.11,20.36 11.11,25.76 12.7,27.34 24.29,27.34 24.71,26.92 C23.1
  Bottom 0.406: X1.+ 7.62,18.14 7.62,15.28 9.76,13.14 IC2.13
X2_AMP  (via drill 0.5)
  Top 0.305: C10.1 30,6.71 30.06,6.76 R12.1
  Top 0.406: v33.18,4.17 32.38,4.96 D3.C 30.68,5.56 30.32,5.91 | C10.1 30.06,6.17 30.32,5.91 | 30.32,5.91
  Bottom 0.305: U$3.12 32.76,4.27 v33.18,4.17
X2_DRIVE
  Bottom 0.305: U$3.8 25.97,6.77 25.4,7.34 24.15,8.59 IC2.23
X2_OUT
  Top 0.406: X2.+ 9.21,16.23 9.84,15.6 15.56,15.6 16.19,14.96 24.13,14.96 24.71,14.38 C16.1
  Bottom 0.406: IC2.9 13.95,10.54 12.7,11.79 9.21,11.79 X2.+
X3_AMP  (via drill 0.5)
  Top 0.305: 11.23,6.51 11.27,6.55 | 11.23,6.51 D1.C | 11.23,6.51 11.11,6.39 C8.1 11.69,5.02 12.54,4.17 13.81,4.17 14.03,3.95 R4.1
  Top 0.406: v23.5,1.94 14.6,1.94 14.03,2.52 R4.1
  Bottom 0.406: v23.5,1.94 25.4,1.94 25.72,2.26 25.72,3.53 25.96,3.77 U$3.11
X3_DRIVE
  Bottom 0.305: U$3.7 26.08,7.77 25.88,7.98 25.88,8.29 24.61,9.56 24.61,10.52 23.93,11.19 IC2.19
X3_OUT
  Top 0.406: X3.+ 7.14,9.72 7.14,13.85 8.1,14.8 13.81,14.8 14.61,14.01 | C6.1 15.14,13.48 14.61,14.01 | 14.61,14.01
  Bottom 0.406: IC2.7 14.14,9.24 13.18,10.2 8.25,10.2 7.14,9.09 X3.+

### Text on the board
Top: Dot 2.1 | MO